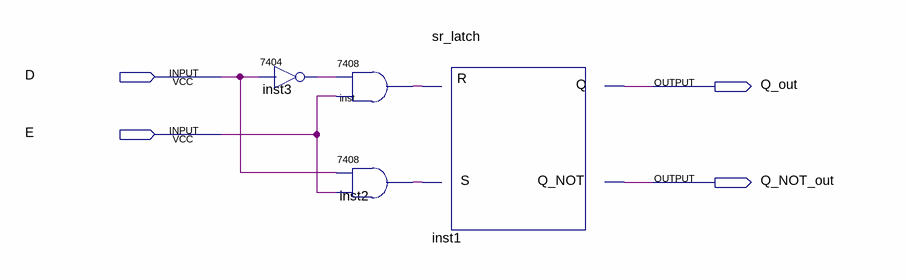
[diagram p0: schematic sheet]
// Quartus schematic d_latch.bdf as structural Verilog: 4 symbols, 4 pins
module d_latch (
  input  D,
  input  E,
  output Q_out,
  output Q_NOT_out
);

  wire inst2_1, inst3_1, inst_1;

  \7404  inst3 (.\2 (D), .\1 (inst3_1));
  \7408  inst (.\3 (E), .\2 (inst3_1), .\1 (inst_1));
  \7408  inst2 (.\3 (E), .\2 (D), .\1 (inst2_1));
  sr_latch inst1 (.R(inst_1), .S(inst2_1), .Q(Q_out), .Q_NOT(Q_NOT_out));
endmodule
